# Altium schematic sheet LIDO-HW.004.RevisionHistory.SchDoc
size A3; CompanyName: EST-Floattech; DrawnBy: RR; Organization: EST-Floattech; Address2: Zandsteen 1; Address3: 2132 MZ; Address4: Hoofddorp; DocumentNumber: 21xxx; Revision: 1.0; SheetNumber: 4; SheetTotal: 4
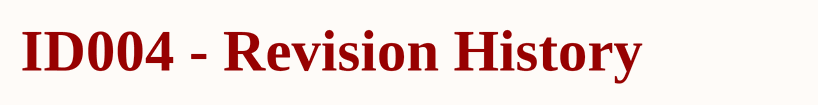
[diagram p0: LIDO-HW.004.RevisionHistory.SchDoc]

## Notes on the sheet
- ID004 - Revision History
- Title:
- Size:
- Date:
- A3
- Sheet       of
- Engineer:
- Version:
- Part Number:
- Revision:
- Rev. date:
- Project:
- File: